# Altium schematic sheet SPI_Header.SchDoc: Title
size A4; Date: *******; ApprovedBy: *******; CheckedBy: None; Author: *******; CompanyName: *******; DrawnBy: Name; Engineer: *******; Organization: *******; Address1: *******; Address2: *******; Address3: *******; Address4: *******; DocumentNumber: 7; Revision: *******; SheetNumber: 7; SheetTotal: 11; CurrentTime: *******; CurrentDate: *******; Time: *******; DocumentFullPathAndName: *******; DocumentName: *******; ModifiedDate: *******; ImagePath: *******; ProjectName: *******; Application_BuildNumber: *******
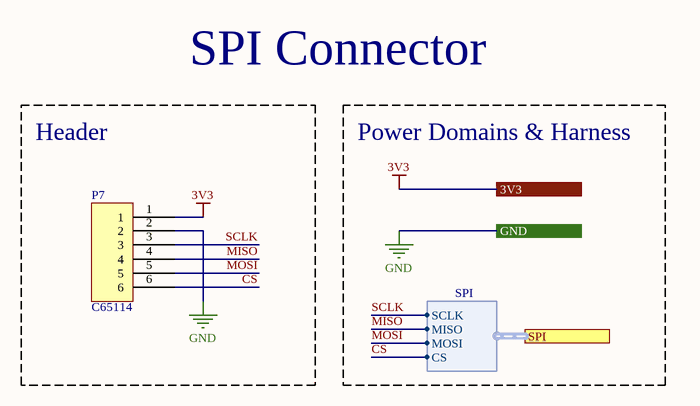
[diagram p0: SPI_Header.SchDoc]

## Parts
P7  Manufacturer Part Number: C65114  [HEADER 3X2]  (hidden comment: HEADER 6POS)

## Blocks framed on the sheet
Header: P7

## Ports
3V3 (see Lens-Maker[3C], A4988[3B], ESP32_Block[3C], ESP32_Module[3B], GPIO_Header[3B], I2C_Header[3B], Power[3B], Stepper_Driver[3A]), GND (see Lens-Maker[3C], A4988[3B], ESP32_Block[3D], ESP32_Module[3B], GPIO_Header[3B], I2C_Header[3B], Mechanical_Holes[3B], Power[3C], Stepper_Driver[3B], USB_Connector[3B]), SPI (harness SPI, see Lens-Maker[3C], ESP32_Module[2B])

## Harnesses
SPI: SCLK, MISO, MOSI, CS

## Nets
3V3: P7.1 ; port 3V3
GND: P7.2 ; port GND
CS: P7.6 ; port SPI.CS
MISO: P7.4 ; port SPI.MISO
MOSI: P7.5 ; port SPI.MOSI
SCLK: P7.3 ; port SPI.SCLK

## Notes on the sheet
- SPI Connector
- Power Domains & Harness
- Title:
- Size:
- Date:
- Drawn By:
- Page Contents:
- A4
- Checked By:
- Revision:
- Sheet
- of

## Library data of the parts
P7 = HEADER 6POS: Straight 2 6 2.54mm Black Straight,P=2.54mm  Pin Headers ROHS; Manufacturer: BOOMELE(Boom Precision Elec); Supplier: JLCPCB; Supplier Part Number: C65114